# EAGLE design MUX gate (EAGLE 6.5.0)
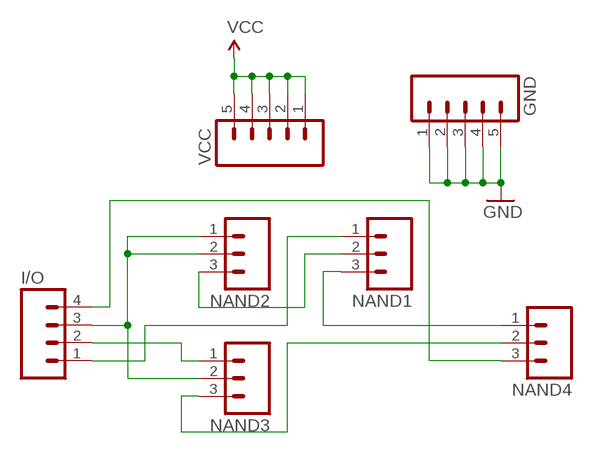
[diagram p0: schematic, sheet 1]

## Parts
GND  M05LOCK  [1X05_LOCK]
I/O  M04LOCK  [1X04_LOCK]
NAND1  M03LOCK  [1X03_LOCK]
NAND2  M03LOCK  [1X03_LOCK]
NAND3  M03LOCK  [1X03_LOCK]
NAND4  M03LOCK  [1X03_LOCK]
VCC  M05LOCK  [1X05_LOCK]

## Nets
GND: GND.1 GND.2 GND.3 GND.4 GND.5
N$1: I/O.1 NAND1.1
N$2: I/O.2 NAND3.1
N$3: I/O.3 NAND2.1 NAND2.2 NAND3.2
N$4: NAND1.2 NAND2.3
N$5: NAND1.3 NAND4.1
N$6: NAND3.3 NAND4.2
N$7: I/O.4 NAND4.3
VCC: VCC.1 VCC.2 VCC.3 VCC.4 VCC.5

## Library data of the parts
GND VCC = SparkFun-Connectors:M05: Header 5 Standard 5-pin 0.1" header. Use with straight break away headers (SKU : PRT-00116), right angle break away headers (PRT-00553), swiss pins (PRT-00743), machine pins (PRT-00117), and female headers (PRT-00115). Molex polarized connector foot print use with SKU : PRT-08230 with associated crimp pins and housings.
I/O = SparkFun-Connectors:M04: Header 4 Standard 4-pin 0.1" header. Use with straight break away headers (SKU : PRT-00116), right angle break away headers (PRT-00553), swiss pins (PRT-00743), machine pins (PRT-00117), and female headers (PRT-00115). Molex polarized connector foot print use with SKU : PRT-08231 with associated crimp pins and housings. 1MM SMD Version SKU: PRT-10208
NAND1-NAND4 = SparkFun-Connectors:M03: Header 3 Standard 3-pin 0.1" header. Use with straight break away headers (SKU : PRT-00116), right angle break away headers (PRT-00553), swiss pins (PRT-00743), machine pins (PRT-00117), and female headers (PRT-00115). Molex polarized connector foot print use with SKU : PRT-08232 with associated crimp pins and housings.

## Board
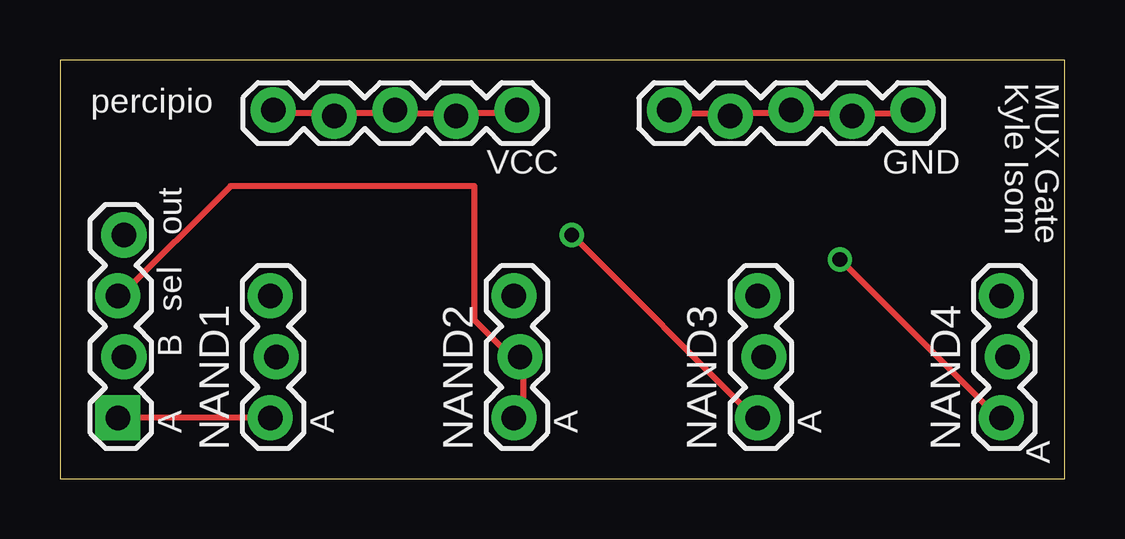
[diagram p1: board, top side]
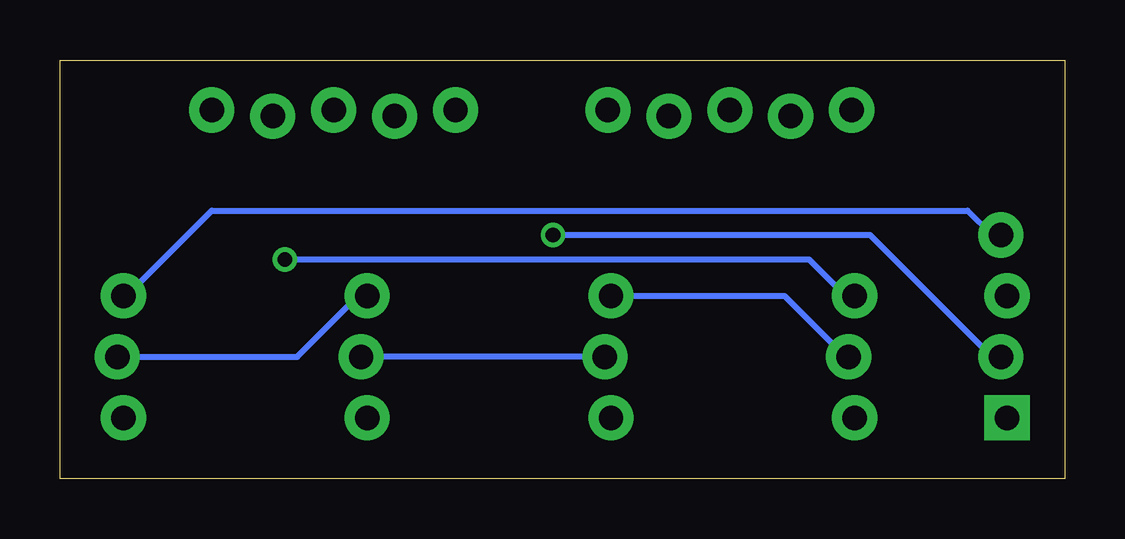
[diagram p2: board, bottom side, seen from below]

Size 41.89 x 17.45 mm. Coordinates in mm from the lower left corner, seen from the top.
Outline: 0,0 41.89,0 41.89,17.45 0,17.45 0,0
Copper layers (1*16): Top 0.035mm / dielectric 1.5mm / Bottom 0.035mm
Design rules "default": minimum track width 10mil, minimum drill 24mil, track to track 8mil, track to pad 8mil, pad to pad 8mil, via to via 8mil, smd to smd 8mil, copper to edge 40mil, drill to drill 8mil, minimum pad ring 10mil, minimum via ring 8mil, stop-mask expansion 4mil, vias tented up to drill 0mil, thermal gap 10mil

### Footprints (pad centres in the part's own frame; a part is rotated, then mirrored left to right if it is on the bottom)
1X05_LOCK = drill 1.016 pad 1.88: 1 0,0.127; 2 2.54,-0.127; 3 5.08,0.127; 4 7.62,-0.127; 5 10.16,0.127
1X04_LOCK = drill 1.016 pad 1.88 square: 1 0,0.127 | drill 1.016 pad 1.88: 2 2.54,-0.127; 3 5.08,0.127; 4 7.62,-0.127
1X03_LOCK = drill 1.016 pad 1.88: 1 0,0.127; 2 2.54,-0.127; 3 5.08,0.127

### Placement (x,y rotation side)
GND  25.4,15.24 0 top
I/O  2.54,2.54 90 top
NAND1  8.89,2.54 90 top
NAND2  19.05,2.54 90 top
NAND3  29.21,2.54 90 top
NAND4  39.37,2.54 90 top
VCC  8.89,15.24 0 top

### Tracks (layer width: path | path; a pad name or v marks a point on that pad's centre or on a via)
GND
  Top 0.254: 27.94,15.24 25.4,15.24 GND.1 | 30.48,15.24 33.02,15.24 | 33.02,15.24 35.56,15.24 GND.5 | 33.02,15.24 GND.4 | 30.48,15.24 27.94,15.24 | 27.94,15.24 GND.2 | 30.48,15.24 GND.3
N$1
  Top 0.254: NAND1.1 I/O.1
N$2  (via drill 0.61)
  Top 0.254: v21.34,10.16 28.96,2.54 NAND3.1
  Bottom 0.254: v21.34,10.16 8.13,10.16 3.05,5.08 I/O.2
N$3
  Top 0.254: NAND2.1 19.3,2.54 19.3,5.08 NAND2.2 18.8,5.08 17.27,6.6 17.27,12.19 7.11,12.19 2.54,7.62 I/O.3
  Bottom 0.254: NAND2.2 NAND3.2
N$4
  Bottom 0.254: NAND2.3 11.68,7.62 9.14,5.08 NAND1.2
N$5  (via drill 0.61)
  Top 0.254: v32.51,9.14 39.12,2.54 NAND4.1
  Bottom 0.254: v32.51,9.14 10.67,9.14 9.14,7.62 NAND1.3
N$6
  Bottom 0.254: NAND4.2 32,5.08 29.46,7.62 NAND3.3
N$7
  Bottom 0.254: I/O.4 3.05,10.16 4.06,11.18 35.56,11.18 39.12,7.62 NAND4.3
VCC
  Top 0.254: VCC.5 18.8,15.24 16.76,15.24 VCC.4 16.26,15.24 14.22,15.24 VCC.3 13.72,15.24 11.68,15.24 VCC.2 11.18,15.24 9.14,15.24 VCC.1

### Text on the board
tPlace: Kyle Isom | MUX Gate | percipio | VCC | GND | out | sel | B | A | A | A | A | A